# EAGLE design picprog (EAGLE 8.4.1)
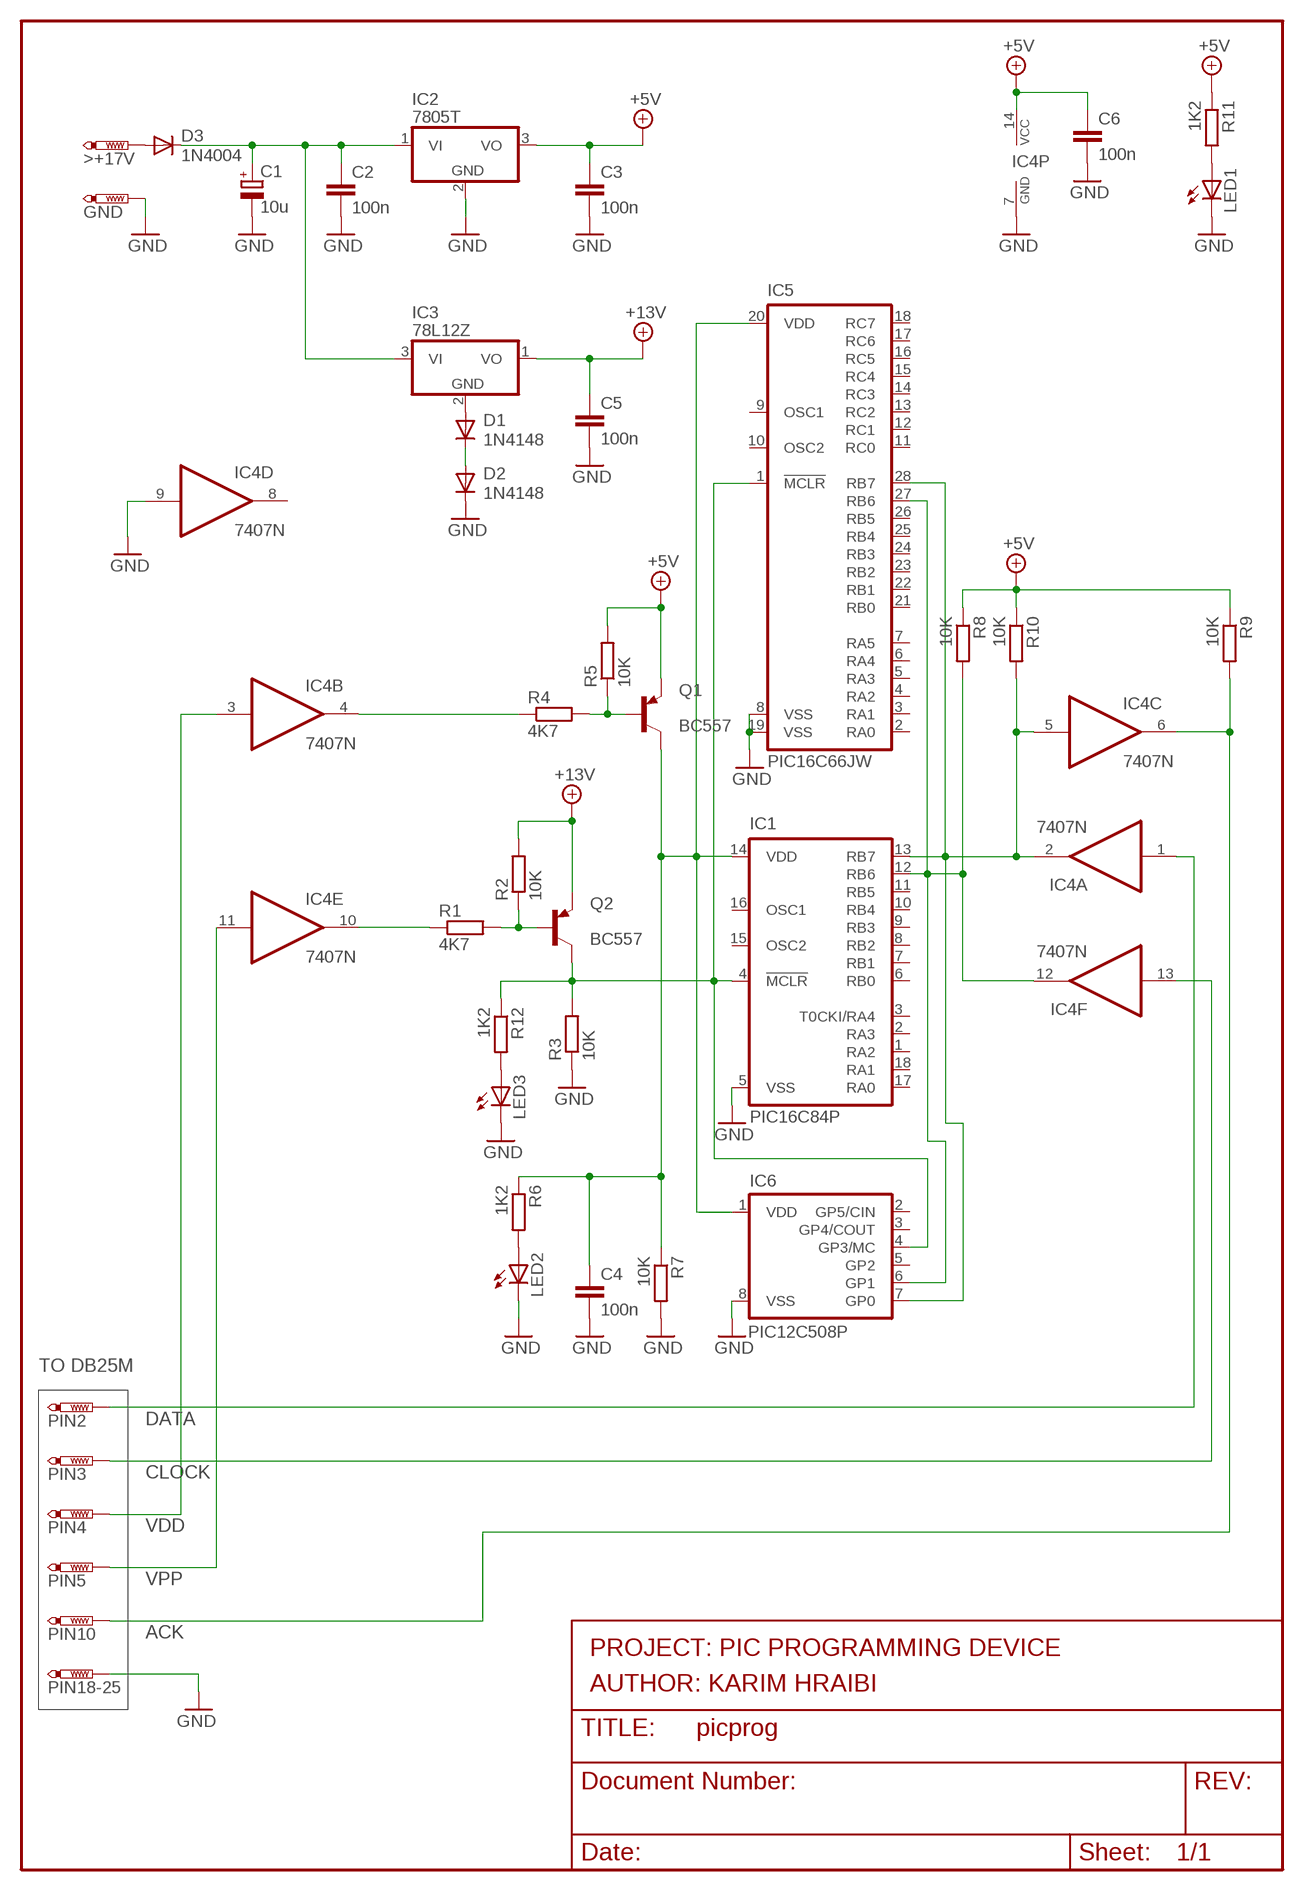
[diagram p0: schematic, sheet 1]

## Parts
>+17V  PTR1PAD1  [P1]
C1  10u  CPOL-EUE2.5-7  [E2,5-7]
C2  100n  C-EU025-025X050  [C025-025X050]
C3  100n  C-EU025-025X050  [C025-025X050]
C4  100n  C-EU025-025X050  [C025-025X050]
C5  100n  C-EU025-025X050  [C025-025X050]
C6  100n  C-EU025-025X050  [C025-025X050]
D1  1N4148  [DO35-10]
D2  1N4148  [DO35-10]
D3  1N4004  [DO41-10]
GND  PTR1PAD1  [P1]
IC1  PIC16C84P  [DIL18]
IC2  7805T  [TO220H]
IC3  78L12Z  [TO92]
IC4  7407N  [DIL14]
IC5  PIC16C66JW  [DIL28-6]
IC6  PIC12C508P  [DIL8]
LED1  LED5MM  [LED5MM]
LED2  LED5MM  [LED5MM]
LED3  LED5MM  [LED5MM]
PIN2  PTR1PAD1  [P1]
PIN3  PTR1PAD1  [P1]
PIN4  PTR1PAD1  [P1]
PIN5  PTR1PAD1  [P1]
PIN10  PTR1PAD1  [P1]
PIN18-25  PTR1PAD1  [P1]
Q1  BC557  BC327  [TO92]
Q2  BC557  BC327  [TO92]
R1  4K7  R-EU_0207/12  [0207/12]
R2  10K  R-EU_0207/12  [0207/12]
R3  10K  R-EU_0207/12  [0207/12]
R4  4K7  R-EU_0207/15  [0207/15]
R5  10K  R-EU_0207/12  [0207/12]
R6  1K2  R-EU_0207/12  [0207/12]
R7  10K  R-EU_0207/12  [0207/12]
R8  10K  R-EU_0207/12  [0207/12]
R9  10K  R-EU_0207/15  [0207/15]
R10  10K  R-EU_0207/12  [0207/12]
R11  1K2  R-EU_0207/12  [0207/12]
R12  1K2  R-EU_0207/12  [0207/12]

## Nets
+5V: C3.1 C6.1 IC2.3(VO) IC4.14(P:VCC) Q1.1(E) R5.2 R8.1 R9.1 R10.1 R11.1
+12V: C5.1 IC3.1(VO) Q2.1(E) R2.2 ; supply symbol labelled +13V
ACK: IC4.6(C:O) PIN10.P$1(TP) R9.2
CLOCK: IC4.13(F:I) PIN3.P$1(TP)
DATA: IC4.1(A:I) PIN2.P$1(TP)
GND: C1.- C2.2 C3.2 C4.2 C5.2 C6.2 D2.C GND.P$1(TP) IC1.5(VSS) IC2.2(GND) IC4.7(P:GND) IC4.9(D:I) IC5.8(VSS) IC5.19(VSS) IC6.8(VSS) LED1.K(C) LED2.K(C) LED3.K(C) PIN18-25.P$1(TP) R3.1 R7.2
N$1: D1.A IC3.2(GND)
N$2: D1.C D2.A
N$3: >+17V.P$1(TP) D3.A
N$4: C1.+ C2.1 D3.C IC2.1(VI) IC3.3(VI)
N$5: IC1.4(!MCLR) IC5.1(!MCLR) IC6.4(GP3/MC) Q2.3(C) R3.2 R12.1
N$6: IC4.10(E:O) R1.1
N$7: Q1.2(B) R4.2 R5.1
N$8: Q2.2(B) R1.2 R2.1
N$9: IC1.13(RB7) IC4.2(A:O) IC4.5(C:I) IC5.28(RB7) IC6.7(GP0) R10.2
N$10: IC4.4(B:O) R4.1
N$11: C4.1 IC1.14(VDD) IC5.20(VDD) IC6.1(VDD) Q1.3(C) R6.1 R7.1
N$12: LED1.A R11.2
N$13: IC1.12(RB6) IC4.12(F:O) IC5.27(RB6) IC6.6(GP1) R8.2
N$14: LED2.A R6.2
N$16: LED3.A R12.2
VDD: IC4.3(B:I) PIN4.P$1(TP)
VPP: IC4.11(E:I) PIN5.P$1(TP)
Unconnected: IC1.1(RA2) IC1.2(RA3) IC1.3(T0CKI/RA4) IC1.6(RB0) IC1.7(RB1) IC1.8(RB2) IC1.9(RB3) IC1.10(RB4) IC1.11(RB5) IC1.15(OSC2) IC1.16(OSC1) IC1.17(RA0) IC1.18(RA1) IC4.8(D:O) IC5.2(RA0) IC5.3(RA1) IC5.4(RA2) IC5.5(RA3) IC5.6(RA4) IC5.7(RA5) IC5.9(OSC1) IC5.10(OSC2) IC5.11(RC0) IC5.12(RC1) IC5.13(RC2) IC5.14(RC3) IC5.15(RC4) IC5.16(RC5) IC5.17(RC6) IC5.18(RC7) IC5.21(RB0) IC5.22(RB1) IC5.23(RB2) IC5.24(RB3) IC5.25(RB4) IC5.26(RB5) IC6.2(GP5/CIN) IC6.3(GP4/COUT) IC6.5(GP2)

## Notes on the sheet
- TO DB25M
- PROJECT: PIC PROGRAMMING DEVICE
- AUTHOR: KARIM HRAIBI

## Library data of the parts
>+17V GND PIN2-PIN5 PIN10 PIN18-25 = testpad:PTR1: TEST PIN
C1 = rcl:CPOL-EU: POLARIZED CAPACITOR, European symbol
C2-C6 = rcl:C-EU: CAPACITOR, European symbol
D1 D2 = diode:1N4148: DIODE high speed (Philips)
D3 = diode:1N4004: DIODE general purpose rectifier, 1 A
IC1 = microchip:PIC16C84: MICROCONTROLLER EPROM/ROM-based
IC2 IC3 = linear:78*: Positive VOLTAGE REGULATOR
IC4 = 74xx-eu:74*07: Hex BUFFER, open collector high-voltage output
IC5 = microchip:PIC16C66: MICROCONTROLLER
IC6 = microchip:PIC12C*?: MICROCONTROLLER
LED1-LED3 = led:LED: LED OSRAM: - CHIPLED LG R971, LG N971, LY N971, LG Q971, LY Q971, LO R971, LY R971 LH N974, LH R974 LS Q976, LO Q976, LY Q976 LO Q996 - Hyper CHIPLED LW Q18S LB Q993, LB Q99A, LB R99A - SideLED LS A670, LO A670, LY A670, LG A670, LP A670 LB A673, LV A673, LT A673, LW A673 LH A674 LY A675 LS A676, LA A676, LO A676, LY A676, LW A676 LS A679, LY A679, LG A679 - Hyper Micro SIDELED® LS Y876, LA Y876, LO Y876, LY Y876 LT Y87S - SmartLED LW L88C, LW L88S LB L89C, LB L89S, LG L890 LS L89K, LO L89K, LY L89K LS L896, LA L896, LO L896, LY L896 - TOPLED LS T670, LO T670, LY T670, LG T670, LP T670 LSG T670, LSP T670, LSY T670, LOP T670, LYG T670 LG T671, LOG T671, LSG T671 LB T673, LV T673, LT T673, LW T673 LH T674 LS T676, LA T676, LO T676, LY T676, LB T676, LH T676, LSB T676, LW T676 LB T67C, LV T67C, LT T67C, LS T67K, LO T67K, LY T67K, LW E67C LS E67B, LA E67B, LO E67B, LY E67B, LB E67C, LV E67C, LT E67C LW T67C LS T679, LY T679, LG T679 LS T770, LO T770, LY T770, LG T770, LP T770 LB T773, LV T773, LT T773, LW T773 LH T774 LS E675, LA E675, LY E675, LS T675 LS T776, LA T776, LO T776, LY T776, LB T776 LHGB T686 LT T68C, LB T68C - Hyper Mini TOPLED® LB M676 - Mini TOPLED Santana® LG M470 LS M47K, LO M47K, LY M47K Source: http://www.osram.convergy.de/
Q1 Q2 = transistor-pnp:BC327: PNP Transistor
R1-R12 = rcl:R-EU_: RESISTOR, European symbol

## Board
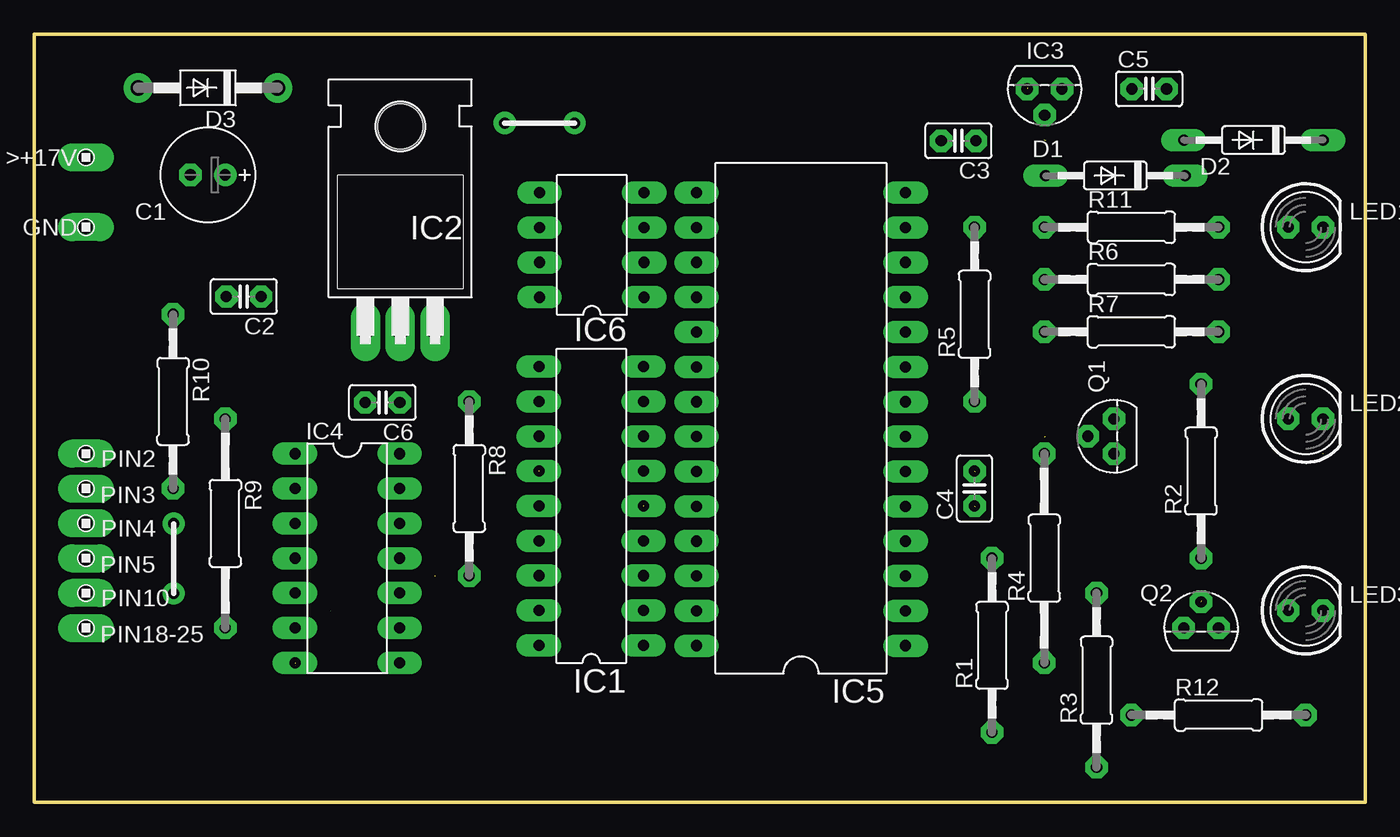
[diagram p1: board, top side]
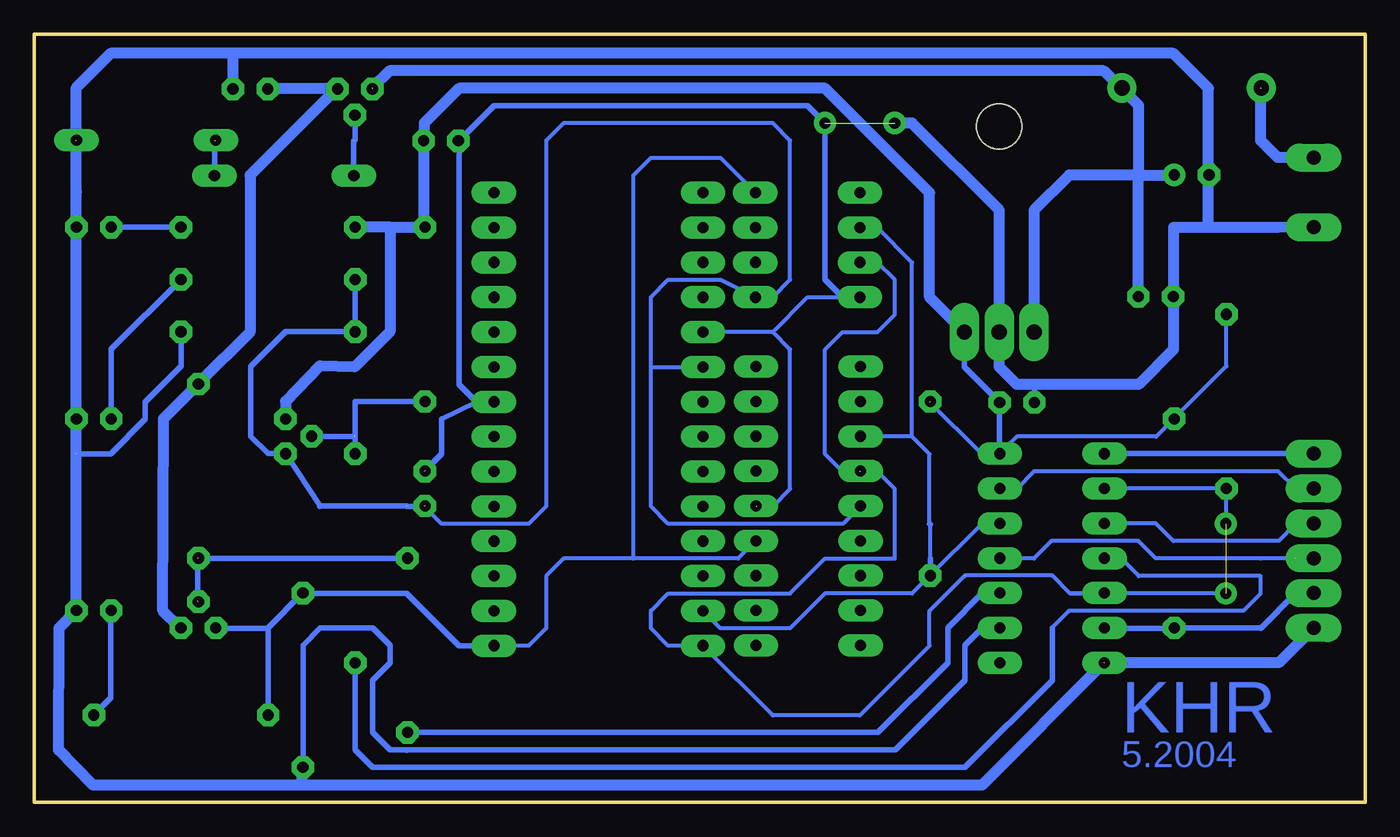
[diagram p2: board, bottom side, seen from below]

Size 97 x 56 mm. Coordinates in mm from the lower left corner, seen from the top.
Outline: 0,0 0,56 97,56 97,0 0,0
Copper layers (1*16): Top 0.035mm / dielectric 1.5mm / Bottom 0.035mm
Design rules "custom": minimum track width 10mil, minimum drill 24mil, track to track 8mil, track to pad 8mil, pad to pad 8mil, via to via 8mil, smd to smd 8mil, copper to edge 40mil, drill to drill 8mil, minimum pad ring 10mil, minimum via ring 8mil, stop-mask expansion 4mil, vias tented up to drill 0mil, thermal gap 10mil

### Footprints (pad centres in the part's own frame; a part is rotated, then mirrored left to right if it is on the bottom)
P1 = drill 1.016 long: P$1 0,0
E2,5-7 = drill 0.813 pad 1.6: + -1.27,0 | drill 0.813 pad 1.6 octagon: - 1.27,0
C025-025X050 = drill 0.813 octagon: 1 -1.27,0; 2 1.27,0
DO35-10 = drill 0.813 long: A 5.08,0; C -5.08,0
DO41-10 = drill 1.118: A 5.08,0; C -5.08,0
DIL18 = drill 0.813 long: 1 -10.16,-3.81; 2 -7.62,-3.81; 3 -5.08,-3.81; 4 -2.54,-3.81; 5 0,-3.81; 6 2.54,-3.81; 7 5.08,-3.81; 8 7.62,-3.81; 9 10.16,-3.81; 10 10.16,3.81; 11 7.62,3.81; 12 5.08,3.81; 13 2.54,3.81; 14 0,3.81; 15 -2.54,3.81; 16 -5.08,3.81; 17 -7.62,3.81; 18 -10.16,3.81
TO220H = drill 1.118 long: 1 -2.54,-10.16; 2 0,-10.16; 3 2.54,-10.16 | hole 3.302: 0,4.826
TO92 = drill 0.813 octagon: 1 -1.27,0; 2 0,1.905; 3 1.27,0
DIL14 = drill 0.813 long: 1 -7.62,-3.81; 2 -5.08,-3.81; 3 -2.54,-3.81; 4 0,-3.81; 5 2.54,-3.81; 6 5.08,-3.81; 7 7.62,-3.81; 8 7.62,3.81; 9 5.08,3.81; 10 2.54,3.81; 11 0,3.81; 12 -2.54,3.81; 13 -5.08,3.81; 14 -7.62,3.81
DIL28-6 = drill 0.813 long: 1 -16.51,-7.62; 2 -13.97,-7.62; 3 -11.43,-7.62; 4 -8.89,-7.62; 5 -6.35,-7.62; 6 -3.81,-7.62; 7 -1.27,-7.62; 8 1.27,-7.62; 9 3.81,-7.62; 10 6.35,-7.62; 11 8.89,-7.62; 12 11.43,-7.62; 13 13.97,-7.62; 14 16.51,-7.62; 15 16.51,7.62; 16 13.97,7.62; 17 11.43,7.62; 18 8.89,7.62; 19 6.35,7.62; 20 3.81,7.62; 21 1.27,7.62; 22 -1.27,7.62; 23 -3.81,7.62; 24 -6.35,7.62; 25 -8.89,7.62; 26 -11.43,7.62; 27 -13.97,7.62; 28 -16.51,7.62
DIL8 = drill 0.813 long: 1 -3.81,-3.81; 2 -1.27,-3.81; 3 1.27,-3.81; 4 3.81,-3.81; 5 3.81,3.81; 6 1.27,3.81; 7 -1.27,3.81; 8 -3.81,3.81
LED5MM = drill 0.813 octagon: A -1.27,0; K 1.27,0
TO92' = drill 0.813 octagon: 1 1.27,0; 2 0,1.905; 3 -1.27,0
0207/12 = drill 0.813 octagon: 1 -6.35,0; 2 6.35,0
0207/15 = drill 0.813 octagon: 1 -7.62,0; 2 7.62,0

### Placement (x,y rotation side)
>+17V  3.76,47.02 90 top
C1  12.65,45.75 180 top
C2  15.27,36.88 180 top
C3  67.36,48.23 180 top
C4  68.53,22.89 90 top
C5  81.25,52.02 0 top
C6  25.37,29.16 180 top
D1  78.79,45.69 180 top
D2  88.85,48.29 180 top
D3  12.65,52.1 180 top
GND  3.76,41.94 90 top
IC1  40.59,21.62 90 top
IC2  26.67,44.45 0 top
IC3  73.63,52.02 180 top
IC4  22.81,17.81 270 top
IC5  55.88,27.94 90 top
IC6  40.64,40.64 90 top
LED1  92.66,41.94 0 top
LED2  92.66,27.97 0 top
LED3  92.66,14 0 top
PIN2  3.76,25.43 90 top
PIN3  3.76,22.89 270 top
PIN4  3.76,20.35 90 top
PIN5  3.76,17.81 270 top
PIN10  3.76,15.27 90 top
PIN18-25  3.76,12.73 270 top
Q1  BC557  [TO92']  78.69,26.7 90 top
Q2  BC557  [TO92']  85.04,12.73 0 top
R1  69.8,11.46 90 top
R2  85.04,24.16 90 top
R3  77.42,8.92 90 top
R4  73.61,17.81 90 top
R5  68.53,35.59 90 top
R6  79.96,38.13 0 top
R7  79.96,34.32 0 top
R8  31.7,22.89 270 top
R9  13.92,20.35 270 top
R10  10.11,29.24 270 top
R11  79.96,41.94 0 top
R12  86.31,6.38 0 top

### Tracks (layer width: path | path; a pad name or v marks a point on that pad's centre or on a via)
+5V  (1 unrouted)
  Bottom 0.305: R10.1 10.11,31.8 13.97,27.94 15.24,26.67 25.4,26.67 26.67,25.4 | 31.75,29.21 27.97,25.43 26.7,25.43
  Bottom 0.406: 13.97,27.94 R9.1 | 26.67,25.4 26.64,25.43 IC4.14 26.67,25.43 26.67,25.4 | 26.67,25.4 26.7,25.43 | 26.67,25.4 26.67,29.16 C6.1 26.64,29.18 29.21,31.75 IC2.3
  Bottom 0.813: R11.1 71.07,41.94 71.07,41.91 | 71.07,41.91 71.07,34.32 73.66,31.75 76.2,31.83 78.69,29.24 Q1.1 | IC2.3 31.75,36.83 31.75,44.45 39.37,52.07 66.04,52.07 68.58,49.53 68.58,48.26 68.61,48.23 C3.1 68.63,41.96 68.58,41.91 | 71.07,41.91 71.12,41.91 | 68.58,41.91 71.07,41.91 | 68.58,41.91 68.56,41.91 R5.2 68.55,41.94 68.58,41.91
+12V
  Bottom 0.406: Q2.1 86.39,12.73
  Bottom 0.813: 86.39,12.73 87.63,13.97 87.58,27.99 85.06,30.51 R2.2 85.04,30.53 81.28,34.29 81.28,45.72 74.93,52.07 | 74.93,52.07 74.9,52.04 IC3.1 | C5.1 74.98,52.02 74.93,52.07
ACK
  Bottom 0.305: PIN10.P$1 5.05,15.27
  Bottom 0.406: 5.05,15.27 5.08,15.24 7.57,12.73 7.59,12.73 7.62,12.7 7.65,12.73 13.94,12.73 | 13.94,12.73 R9.2 | 13.94,12.73 13.97,12.7 19.05,12.7 19.02,12.73 IC4.6
CLOCK
  Bottom 0.305: PIN3.P$1 5.05,22.89 6.35,24.13 24.13,24.13 25.4,22.86 26.65,22.86 | 26.65,22.86 26.67,22.86 | 26.65,22.86 IC4.13
DATA
  Bottom 0.406: 19.02,25.43 IC4.1 | PIN2.P$1 19.02,25.43 | 19.02,25.43 19.05,25.4
GND  (via drill 0.81 pad 1.42)  (6 unrouted)
  Bottom 0.305: 44.37,21.59 43.18,21.59 41.91,22.86 41.91,33.02 43.18,34.29 | 43.18,34.29 IC5.19 | IC6.8 40.64,36.83 43.18,34.29
  Bottom 0.406: IC4.9 27.89,12.73 29.16,11.46 29.16,8.92 34.24,3.84 69.82,3.84 69.85,3.81 69.89,3.85 71.08,3.85 72.34,5.11 72.34,8.92 71.07,10.16 71.07,11.46 72.34,12.73 76.15,12.73 77.42,11.46 77.42,2.59 77.47,2.54 77.44,2.57 R3.1 | R7.2 86.31,31.8 88.9,29.21 88.9,27.94 91.44,25.4 93.93,25.4 | 64.77,29.21 67.31,27.94 67.31,25.4 68.58,24.13 | IC6.8 38.1,36.83 39.37,38.1 v39.37,49.53 40.64,50.8 63.5,50.8 66.04,48.26 | 64.77,29.21 66.04,30.48 66.04,48.26 | 64.77,29.21 IC5.8 | C6.2 24.1,30.45 24.13,30.48 | 66.04,48.26 66.07,48.23 C3.2
  Bottom 0.813: PIN18-25.P$1 6.3,10.19 IC4.7 | 93.93,25.4 LED3.K 95.2,12.73 95.22,3.84 92.71,1.27 77.47,1.27 | 11.43,41.91 6.35,41.91 GND.P$1 | 11.43,41.91 13.97,41.91 13.97,39.42 | 93.98,48.26 93.98,52.07 91.44,54.61 82.55,54.61 | 77.47,1.27 27.92,1.27 27.92,1.29 19.05,10.16 | 77.47,1.27 77.47,2.54 | v34.29,49.53 33.02,49.53 26.67,43.18 IC2.2 26.67,31.75 25.4,30.48 24.13,30.48 16.51,30.48 13.97,33.02 13.97,39.42 | 93.93,25.45 LED2.K LED1.K 93.95,43.21 93.93,44.5 D2.C | 82.55,54.61 13.97,54.61 11.43,52.07 11.43,45.72 | 11.43,45.72 11.4,45.75 C1.- | 11.43,41.91 11.43,45.72 | 13.97,39.42 C2.2 | C5.2 82.52,54.58 82.55,54.61
N$1  (1 unrouted)
  Bottom 0.406: D1.A 73.71,48.26 | IC3.2 73.63,48.29
N$2  (1 unrouted)
  Bottom 0.406: D1.C 83.87,47.04 83.82,48.26
N$3  (1 unrouted)
  Bottom 0.813: >+17V.P$1 6.38,47.02 7.62,48.26 7.62,52.07
N$4  (1 unrouted)
  Bottom 0.813: 17.78,52.07 19.05,53.34 71.12,53.34 72.36,52.1 72.39,52.07 | 16.51,45.75 21.56,45.75 24.13,43.18 IC2.1 | 16.51,45.75 C1.+ | 16.51,45.75 16.51,45.72 16.54,45.69 C2.1 | 16.51,45.75 16.51,50.8 17.78,52.07 | 17.78,52.07 17.75,52.1 D3.C
N$5
  Bottom 0.305: IC1.4 45.7,17.78 53.34,17.78 | 53.34,17.78 58.42,17.78 59.69,16.51 59.69,12.7 60.96,11.43 IC5.1 | IC6.4 46.99,46.99 52.07,46.99 53.34,45.72 53.34,17.78
  Bottom 0.406: IC5.1 66.04,11.43 69.85,15.24 77.47,15.24 | R12.1 79.96,12.65 80.01,12.7 | 77.47,15.24 77.44,15.27 R3.2 | 77.47,15.24 80.01,12.7 | Q2.3 83.79,12.73 83.82,12.7 80.01,12.7
N$6
  Bottom 0.406: R1.1 35.51,5.11 30.43,10.19 30.43,12.73 27.89,15.27 IC4.10
N$7  (1 unrouted)
  Bottom 0.406: R5.1 73.61,29.24 73.61,26.67 R4.2 | 73.69,26.7 Q1.2
N$8  (2 unrouted)
  Bottom 0.406: R1.2 R2.1 | 85.09,14.68 85.09,17.78
N$9  (via drill 0.81 pad 1.42)  (3 unrouted)
  Bottom 0.305: 29.18,16.54 22.81,16.54 21.51,15.24 | 29.21,16.51 31.75,13.97 31.75,11.43 36.83,6.35 43.18,6.35 IC5.28 50.8,11.43 52.07,12.7 52.07,13.97 50.8,15.24 41.91,15.24 39.37,17.78 34.29,17.78 34.29,22.86 35.56,24.13 36.83,24.13 38.1,24.13 39.37,25.4 39.37,33.02 38.1,34.29 35.56,34.29 34.29,35.56 34.29,38.1 35.56,39.37 IC6.7 | 10.16,22.84 v10.16,20.32 | 10.19,22.89 IC4.2 | IC4.5 19.03,15.24 21.51,15.24 | v10.16,15.24 21.51,15.24
  Bottom 0.406: 10.16,22.84 R10.2 10.13,22.89 10.16,22.86 10.19,22.89
N$10  (1 unrouted)
  Bottom 0.305: IC4.4 18.97,17.78 17.78,17.78 16.51,16.51 7.62,16.51 7.62,15.24 8.89,13.97 21.59,13.97 | 22.81,12.7 22.86,12.7 21.6,13.96 21.58,13.96
  Bottom 0.406: 22.81,12.73 22.81,12.7 22.81,8.92 29.16,2.57 72.34,2.57 73.61,3.84 R4.1
N$11  (2 unrouted)
  Bottom 0.305: 52.07,31.75 IC5.20 | IC1.14 38.08,20.32 50.8,20.32 52.07,21.59 52.07,31.75 | 52.07,31.75 52.07,36.83 50.8,38.1 46.99,38.1 IC6.1 43.18,36.83 41.91,38.1 41.91,48.26 43.18,49.53 58.42,49.53 59.69,48.26 59.69,21.59 60.96,20.32 67.31,20.32 68.58,21.59
  Bottom 0.406: R6.1 R7.1 78.69,34.32 81.23,31.78 81.23,26.7 79.96,25.43 Q1.3 76.15,21.62 76.17,21.62 | 68.58,21.59 69.82,21.59 | 69.85,21.62 76.17,21.62 | 76.17,21.62 76.2,21.59
N$12
  Bottom 0.406: R11.2 LED1.A
N$13
  Bottom 0.254: 31.7,17.78 31.75,17.78
  Bottom 0.305: 31.7,17.78 31.7,20.27 | IC5.27 46.99,12.7 41.91,12.7 39.37,15.24 33.02,15.24 31.72,16.54 27.91,20.35 | 31.75,20.32 31.75,25.4 33.02,26.67 | 33.02,26.67 36.81,26.67 | IC1.12 34.32,26.7 33.02,26.67 | 33.02,26.67 33.02,39.37 35.56,41.91 IC6.6
  Bottom 0.406: 31.7,17.78 R8.2 31.72,16.54 | 31.7,20.27 31.75,20.32 | 27.91,20.35 IC4.12
N$14
  Bottom 0.406: R6.2 91.39,33.05 LED2.A
N$16
  Bottom 0.406: R12.2 91.44,7.62 91.44,13.95 LED3.A
VDD
  Bottom 0.305: PIN4.P$1 5.05,20.35 | 5.08,20.32 6.3,19.08 8.84,19.08 13.97,19.05 15.27,20.35 IC4.3
  Bottom 0.406: 5.05,20.35 5.08,20.32
VPP  (1 unrouted)
  Bottom 0.305: PIN5.P$1 5.05,17.81 | 5.08,17.78 7.62,17.78 15.27,17.81 16.54,19.08 16.56,19.05 22.86,19.05 24.13,17.78 26.65,17.78 | 26.65,17.78 26.67,17.78 | 26.65,17.78 IC4.11

### Text on the board
Bottom: KHR | 5.2004